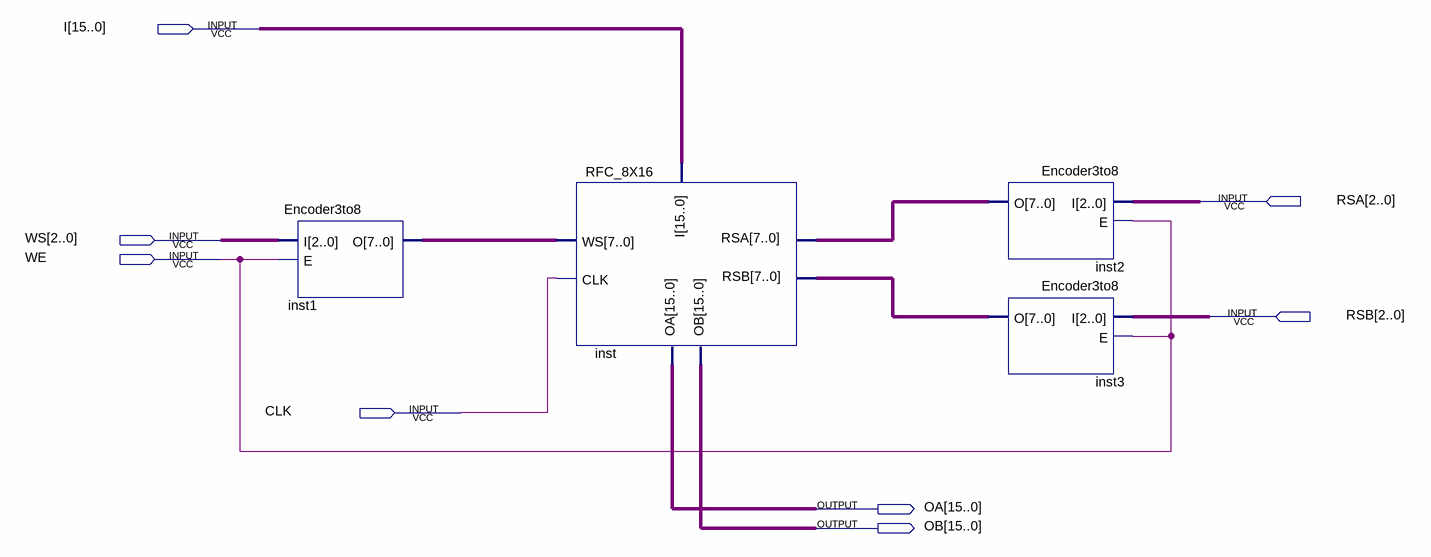
[diagram p0: schematic sheet]
// Quartus schematic Registerfile.bdf as structural Verilog: 4 symbols, 8 pins
module Registerfile (
  input  [15:0] I,
  input  [2:0] RSA,
  input  [2:0] WS,
  input  WE,
  input  [2:0] RSB,
  input  CLK,
  output [15:0] OA,
  output [15:0] OB
);

  wire [7:0] inst1_o, inst2_o, inst3_o;

  Encoder3to8 inst1 (.I(WS), .E(WE), .O(inst1_o));
  RFC_8X16 inst (.WS(inst1_o), .I(I), .CLK(CLK), .RSA(inst2_o), .RSB(inst3_o), .OA(OA), .OB(OB));
  Encoder3to8 inst2 (.I(RSA), .E(WE), .O(inst2_o));
  Encoder3to8 inst3 (.I(RSB), .E(WE), .O(inst3_o));
endmodule
